# Altium schematic sheet LED_Array.SchDoc
size 279 x 167 mm; SheetNumber: 1; SheetTotal: 1
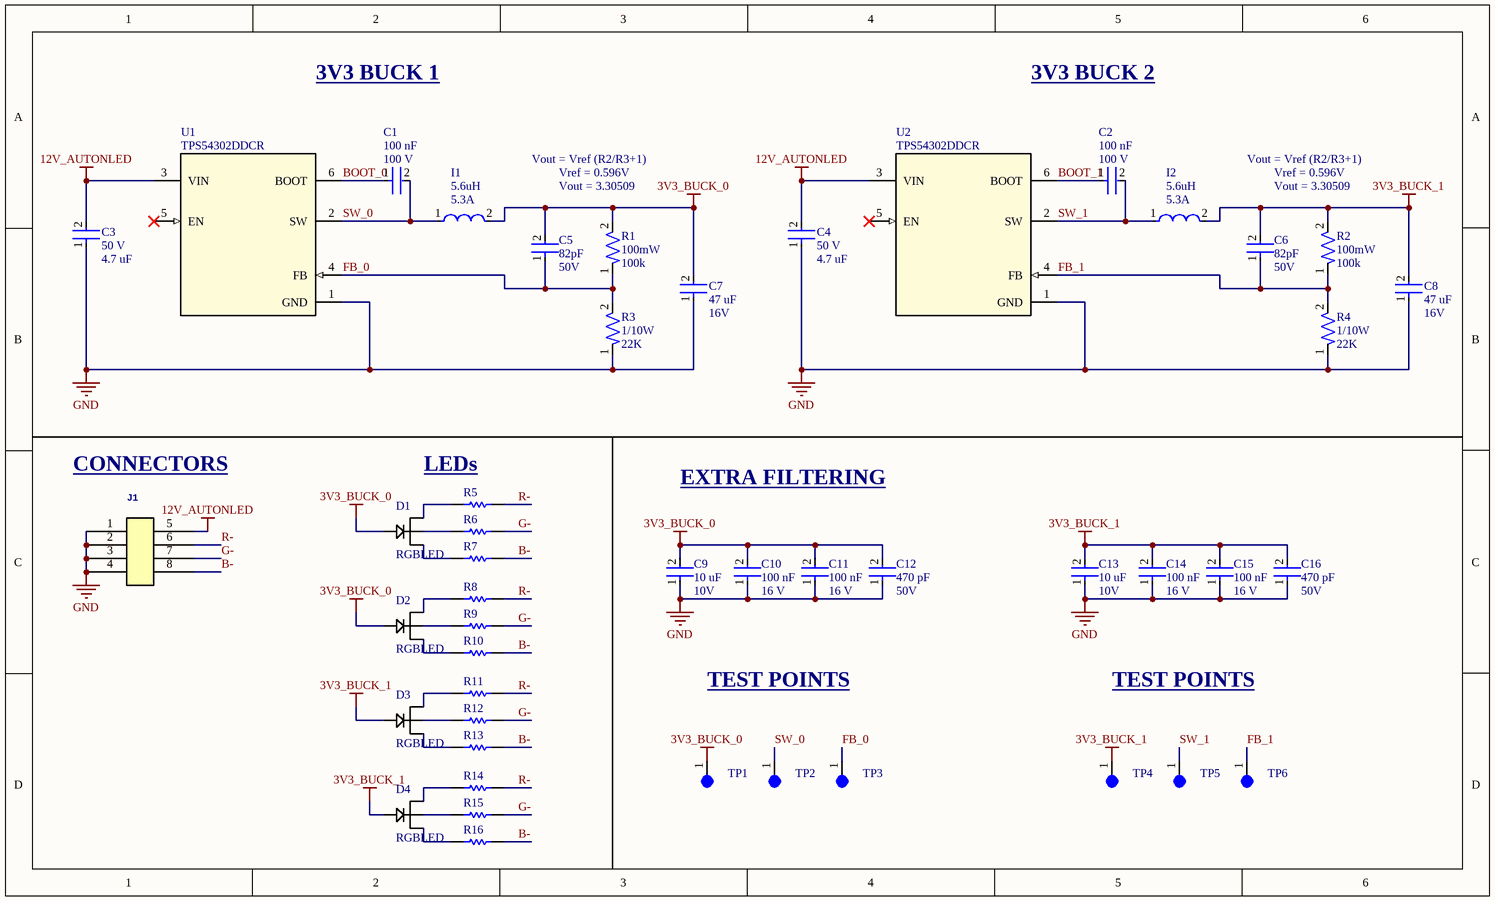
[diagram p0: LED_Array.SchDoc]

## Parts
C1  Capacitance: 100 nF  Voltage: 100 V  [CAP-0603]  (hidden comment: CC0603KRX7R0BB104)
C2  Capacitance: 100 nF  Voltage: 100 V  [CAP-0603]  (hidden comment: CC0603KRX7R0BB104)
C3  Voltage: 50 V  Capacitance: 4.7 uF  [CAP-0805]  (hidden comment: CC0805KKX5R9BB475)
C4  Voltage: 50 V  Capacitance: 4.7 uF  [CAP-0805]  (hidden comment: CC0805KKX5R9BB475)
C5  Voltage: 50V  Capacitance: 82pF  [CAP-0805]  (hidden comment: CC0805JRNPO9BN820)
C6  Voltage: 50V  Capacitance: 82pF  [CAP-0805]  (hidden comment: CC0805JRNPO9BN820)
C7  Capacitance: 47 uF  Voltage: 16V  [CAP-1210]  (hidden comment: GRM32ER61C476KE15L)
C8  Capacitance: 47 uF  Voltage: 16V  [CAP-1210]  (hidden comment: GRM32ER61C476KE15L)
C9  Voltage: 10V  Capacitance: 10 uF  [CAP-0603]  (hidden comment: CC0603KRX5R6BB106)
C10  Voltage Rating: 16 V  Capacitance: 100 nF  [CAP-0402]  (hidden comment: CC0402KRX7R7BB104)
C11  Voltage Rating: 16 V  Capacitance: 100 nF  [CAP-0402]  (hidden comment: CC0402KRX7R7BB104)
C12  Voltage: 50V  Capacitance: 470 pF  [CAP-0805]  (hidden comment: CC0805JRNPO9BN471)
C13  Voltage: 10V  Capacitance: 10 uF  [CAP-0603]  (hidden comment: CC0603KRX5R6BB106)
C14  Voltage Rating: 16 V  Capacitance: 100 nF  [CAP-0402]  (hidden comment: CC0402KRX7R7BB104)
C15  Voltage Rating: 16 V  Capacitance: 100 nF  [CAP-0402]  (hidden comment: CC0402KRX7R7BB104)
C16  Voltage: 50V  Capacitance: 470 pF  [CAP-0805]  (hidden comment: CC0805JRNPO9BN471)
D1  RGBLED  [RGBLED]
D2  RGBLED  [RGBLED]
D3  RGBLED  [RGBLED]
D4  RGBLED  [RGBLED]
I1  Saturation Current: 5.3A  Inductance: 5.6uH  [IND-5.6UH-0001]  (hidden comment: ASPI-1306T-5R6M-T)
I2  Saturation Current: 5.3A  Inductance: 5.6uH  [IND-5.6UH-0001]  (hidden comment: ASPI-1306T-5R6M-T)
J1  Molex 43045-0812  [CONN-8POS-0001]  (value not drawn)
R1  Power: 100mW  Resistance: 100k  [RES-0603]  (hidden comment: RC0603FR-07100KL)
R2  Power: 100mW  Resistance: 100k  [RES-0603]  (hidden comment: RC0603FR-07100KL)
R3  Power: 1/10W  Resistance: 22K  [RES-0603]  (hidden comment: RC0603FR-0722KL)
R4  Power: 1/10W  Resistance: 22K  [RES-0603]  (hidden comment: RC0603FR-0722KL)
R5  Res1  [AXIAL-0.3]  (value not drawn)
R6  Res1  [AXIAL-0.3]  (value not drawn)
R7  Res1  [AXIAL-0.3]  (value not drawn)
R8  Res1  [AXIAL-0.3]  (value not drawn)
R9  Res1  [AXIAL-0.3]  (value not drawn)
R10  Res1  [AXIAL-0.3]  (value not drawn)
R11  Res1  [AXIAL-0.3]  (value not drawn)
R12  Res1  [AXIAL-0.3]  (value not drawn)
R13  Res1  [AXIAL-0.3]  (value not drawn)
R14  Res1  [AXIAL-0.3]  (value not drawn)
R15  Res1  [AXIAL-0.3]  (value not drawn)
R16  Res1  [AXIAL-0.3]  (value not drawn)
TP1  5003  [TEST-POINT-0001]  (value not drawn)
TP2  5003  [TEST-POINT-0001]  (value not drawn)
TP3  5003  [TEST-POINT-0001]  (value not drawn)
TP4  5003  [TEST-POINT-0001]  (value not drawn)
TP5  5003  [TEST-POINT-0001]  (value not drawn)
TP6  5003  [TEST-POINT-0001]  (value not drawn)
U1  TPS54302DDCR  [IC-SOT-23-6]
U2  TPS54302DDCR  [IC-SOT-23-6]

## Nets
3V3_BUCK_0: C5.2 C7.2 C9.2 C10.2 C11.2 C12.2 D1.0 D2.0 I1.2 R1.2 TP1.1
3V3_BUCK_1: C6.2 C8.2 C13.2 C14.2 C15.2 C16.2 D3.0 D4.0 I2.2 R2.2 TP4.1
12V_AUTONLED: C3.2 C4.2 J1.5 U1.3(VIN) U2.3(VIN)
GND: C3.1 C4.1 C7.1 C8.1 C9.1 C10.1 C11.1 C12.1 C13.1 C14.1 C15.1 C16.1 J1.1 J1.2 J1.3 J1.4 R3.1 R4.1 U1.1(GND) U2.1(GND)
B-: J1.8 R7.2 R10.2 R13.2 R16.2
BOOT_0: C1.1 U1.6(BOOT)
BOOT_1: C2.1 U2.6(BOOT)
FB_0: C5.1 R1.1 R3.2 TP3.1 U1.4(FB)
FB_1: C6.1 R2.1 R4.2 TP6.1 U2.4(FB)
G-: J1.7 R6.2 R9.2 R12.2 R15.2
R-: J1.6 R5.2 R8.2 R11.2 R14.2
SW_0: C1.2 I1.1 TP2.1 U1.2(SW)
SW_1: C2.2 I2.1 TP5.1 U2.2(SW)
NetD1_1: D1.1(R-) R5.1
NetD1_2: D1.2(G-) R6.1
NetD1_3: D1.3(B-) R7.1
NetD2_1: D2.1(R-) R8.1
NetD2_2: D2.2(G-) R9.1
NetD2_3: D2.3(B-) R10.1
NetD3_1: D3.1(R-) R11.1
NetD3_2: D3.2(G-) R12.1
NetD3_3: D3.3(B-) R13.1
NetD4_1: D4.1(R-) R14.1
NetD4_2: D4.2(G-) R15.1
NetD4_3: D4.3(B-) R16.1

Not connected (* = marked no-connect by the designer): U1 5(EN)*; U2 5(EN)*

## Notes on the sheet
- 3V3 BUCK 1
- 3V3 BUCK 2
- Vout = Vref (R2/R3+1)
- Vref = 0.596V
- Vout = 3.30509
- CONNECTORS
- LEDs
- EXTRA FILTERING
- TEST POINTS

## Library data of the parts
C1 C2 = CAP-100N-0001: CAP CER 0.1UF 100V X7R 0603; Device Class: Ceramic; Size: 0603; ComponentLink1Description: Datasheet; ComponentLink1URL: https://www.yageo.com/upload/media/product/app/datasheet/mlcc/upy-np0x7r_mv_100-to-630v.pdf
C3 C4 = CAP-4.7U-0002: CAP CER 4.7UF 50V X5R 0805; ComponentLink2Description: Datasheet; ComponentLink2URL: http://www.yageo.com/documents/recent/UPY-GPHC_Y5V_6.3V-to-50V_8.pdf; Device Class: Ceramic; Size: 0805
C5 C6 = CAP-82P-0001: 82 pF ±5% 50V Ceramic Capacitor C0G, NP0 0805 (2012 Metric)
C7 C8 = CAP-47U-0002: CAP CER 47UF 16V X5R 1210; Device Class: Ceramic; Size: 1210; ComponentLink1Description: Datasheet; ComponentLink1URL: https://search.murata.co.jp/Ceramy/image/img/A01X/G101/ENG/GRM32ER61C476KE15-01.pdf
C9 C13 = CAP-10U-0001: CAP CER 10UF 10V X5R 0603; ComponentLink1Description: Datasheet; ComponentLink1URL: https://www.yageo.com/upload/media/product/app/datasheet/mlcc/upy-gphc_x5r_4v-to-50v.pdf; Device Class: Ceramic; Size: 0603
C10 C11 C14 C15 = CAP-0.1U-0001: CAP CER 0.1UF 16V X7R 0402; ComponentLink2Description: Datasheet; ComponentLink2URL: https://www.yageo.com/upload/media/product/productsearch/datasheet/mlcc/UPY-GPHC_X7R_6.3V-to-250V_24.pdf; Device Class: Ceramic; Size: 0402
C12 C16 = CAP-470P-0001: CAP CER 470PF 50V C0G/NPO 0805; Device Class: Ceramic; Size: 0805; ComponentLink1Description: Datasheet; ComponentLink1URL: https://www.yageo.com/upload/media/product/productsearch/datasheet/mlcc/UPY-GP_NP0_16V-to-50V_18.pdf
I1 I2 = IND-5.6U-0001: 5.6 µH Unshielded Drum Core, Wirewound Inductor 5.3 A 20mOhm Max Nonstandard
J1 = CONN-8POS-0001: GateName_1: G$1; SymbolName_1: HEADER_POS8; DeviceSetName: HEADER_POS8_?; DeviceName: 43045-0812; LibraryName: con-molex-micro-fit-3_0_2; Package: 43045-0812
R1 R2 = RES-100k-0001: RES SMD 100K OHM 1% 1/10W 0603; Tolerance: 1%; Size: 0603; ComponentLink1Description: Datasheet; ComponentLink1URL: https://www.yageo.com/upload/media/product/products/datasheet/rchip/PYu-RC_Group_51_RoHS_L_12.pdf
R3 R4 = RES-22k-0001: 22 kOhms ±1% 0.1W, 1/10W Chip Resistor 0603 (1608 Metric) Moisture Resistant Thick Film; Parameter 1: *
R5-R16 = Res1: Resistor; Published: 8-Jun-2000; LatestRevisionDate: 17-Jul-2002; LatestRevisionNote: Re-released for DXP Platform.; PackageReference: AXIAL-0.3; Publisher: Altium Limited; PackageDescription: Axial Device, Thru-Hole; 2 Leads; 0.3 in Pin Spacing
TP1-TP6 = TEST-POINT-0001: Oranange PC Test Point, Miniature Phoisphor Bronze Silver Plating Through Hole Mounting Type
U1 U2 = IC-BUCK-0004: IC REG BUCK ADJ 3A SOT23